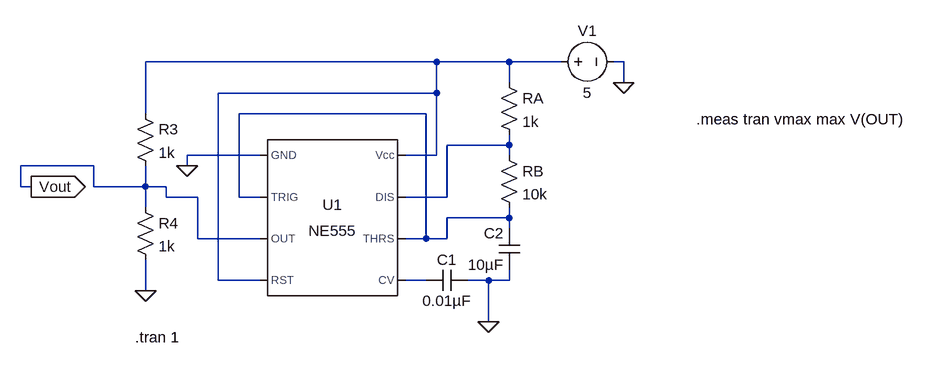
[diagram p0: schematic 555timer.asc]
555timer.asc, the LTspice schematic file:
Version 4.1
SHEET 1 1128 680
WIRE 384 -64 -64 -64
WIRE 496 -64 384 -64
WIRE 576 -64 496 -64
WIRE 672 -64 656 -64
WIRE 496 -32 496 -64
WIRE 672 -32 672 -64
WIRE 384 -16 384 -64
WIRE 384 -16 48 -16
WIRE -64 16 -64 -64
WIRE 368 16 80 16
WIRE 496 64 496 48
WIRE 496 64 400 64
WIRE 112 80 0 80
WIRE 384 80 384 -16
WIRE 384 80 336 80
WIRE 496 80 496 64
WIRE -144 96 -256 96
WIRE 0 96 0 80
WIRE -256 128 -256 96
WIRE -240 128 -256 128
WIRE -144 128 -144 96
WIRE -64 128 -64 96
WIRE -64 128 -144 128
WIRE -32 128 -64 128
WIRE -32 144 -32 128
WIRE 16 144 -32 144
WIRE 80 144 80 16
WIRE 112 144 80 144
WIRE 400 144 400 64
WIRE 400 144 336 144
WIRE -64 160 -64 128
WIRE 496 176 496 160
WIRE 496 176 400 176
WIRE 496 192 496 176
WIRE 16 208 16 144
WIRE 112 208 16 208
WIRE 368 208 368 16
WIRE 368 208 336 208
WIRE 400 208 400 176
WIRE 400 208 368 208
WIRE 48 272 48 -16
WIRE 112 272 48 272
WIRE 368 272 336 272
WIRE 464 272 432 272
WIRE 496 272 496 256
WIRE 496 272 464 272
WIRE -64 288 -64 240
WIRE 464 336 464 272
FLAG 0 96 0
FLAG 464 336 0
FLAG 672 -32 0
FLAG -64 288 0
FLAG -240 128 Vout
IOPIN -240 128 Out
SYMBOL Misc\\NE555 224 176 R0
SYMATTR InstName U1
SYMBOL cap 432 256 R90
WINDOW 0 0 32 VBottom 2
WINDOW 3 32 32 VTop 2
SYMATTR InstName C1
SYMATTR Value 0.01µF
SYMBOL cap 512 256 R180
WINDOW 0 24 56 Left 2
WINDOW 3 24 8 Left 2
SYMATTR InstName C2
SYMATTR Value 10µF
SYMBOL res 480 64 R0
SYMATTR InstName RB
SYMATTR Value 10k
SYMBOL res 480 -48 R0
SYMATTR InstName RA
SYMATTR Value 1k
SYMBOL voltage 560 -64 R270
WINDOW 0 32 56 VTop 2
WINDOW 3 -32 56 VBottom 2
WINDOW 123 0 0 Left 0
WINDOW 39 0 0 Left 0
SYMATTR InstName V1
SYMATTR Value 5
SYMBOL res -80 0 R0
SYMATTR InstName R3
SYMATTR Value 1k
SYMBOL res -80 144 R0
SYMATTR InstName R4
SYMATTR Value 1k
TEXT -80 360 Left 2 !.tran 1
TEXT 784 24 Left 2 !.meas tran vmax max V(OUT)

The netlist it stands for:
* 555timer.asc
X§U1 0 N002 Vout N001 N004 N002 N003 N001 NE555  ; pins GND TRIG OUT RST CV THRS DIS Vcc
C1 0 N004 0.01µF
C2 0 N002 10µF
RB N003 N002 10k
RA N001 N003 1k
V1 N001 0 5
R3 N001 Vout 1k
R4 Vout 0 1k
.tran 1
.meas tran vmax max V(OUT)
.lib NE555.sub
.backanno
.end